# EAGLE design 1-WireThermocouple (EAGLE 9.3.1)
AUTHOR: KTOWN
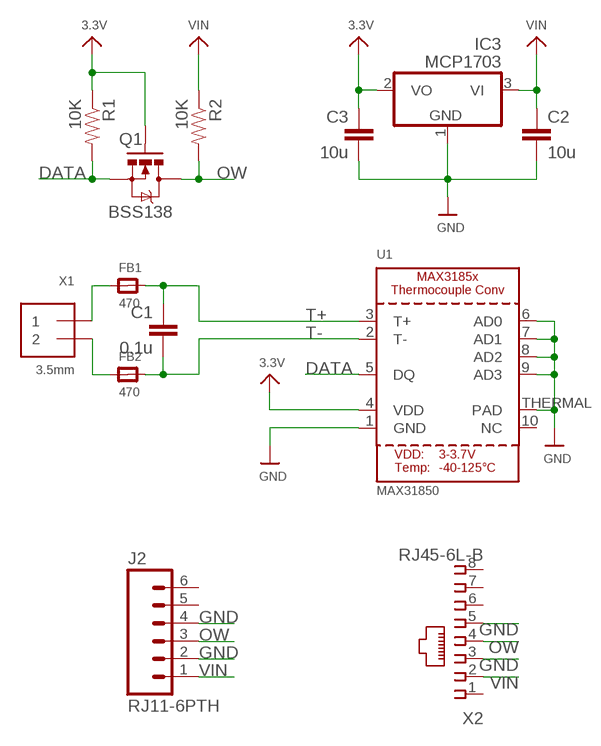
[diagram p0: schematic, sheet 1]

## Parts
C1  0.1u  CAP0603-CAP  [0603-CAP]
C2  10u  CAP0603-CAP  [0603-CAP]
C3  10u  CAP0603-CAP  [0603-CAP]
FB1  470  FERRITE  [0603]
FB2  470  FERRITE  [0603]
IC3  MCP1703  MCP1703CB  [SOT23]
J2  RJ11-6PTH  [RJ11-6]
Q1  BSS138  MOSFET-NCHANNELSMD  [SOT23-3]
R1  10K  RESISTOR0603-RES  [0603-RES]
R2  10K  RESISTOR0603-RES  [0603-RES]
U1  MAX31850  MAX3185X  [TDFN10_3X4MM]
X1  3.5mm  TERMBLOCK_1X2  [TERMBLOCK_1X2-3.5MM]
X2  RJ45-6L-B  [RJ45-NO-SHIELD]

## Nets
3.3V: C3.1 IC3.2(VO) Q1.1(G) R1.1 U1.4(VDD)
DATA: Q1.2(S) R1.2 U1.5(DQ)
GND: C2.2 C3.2 IC3.1(GND) J2.2 J2.4 U1.1(GND) U1.6(AD0) U1.7(AD1) U1.8(AD2) U1.9(AD3) U1.THERMAL(PAD) X2.3 X2.5
N$1: FB1.1 X1.1
N$2: FB2.1 X1.2
OW: J2.3 Q1.3(D) R2.2 X2.4
T+: C1.1 FB1.2 U1.3(T+)
T-: C1.2 FB2.2 U1.2(T-)
VIN: C2.1 IC3.3(VI) J2.1 R2.1 X2.2
Unconnected: J2.5 J2.6 U1.10(NC) X2.1 X2.6 X2.7 X2.8

## Library data of the parts
C1-C3 = SparkFun:CAP: Capacitor Standard 0603 ceramic capacitor, and 0.1" leaded capacitor.
FB1 FB2 = microbuilder:FERRITE: Ferrite Bead 0603 MMZ1608B121C - 120 Ohm @ 100MHz, 600mA, 0.15 Ohm DC Resistance - Digikey: 445-2164-1-ND BK1608HW121-T - 120 Ohm, 600mA Ferrite Chip - Digikey: 587-1876-2-ND 0805 HZ0805B272R-10 - 2.7K Ohm @ 100MHz, 200mA, 0.8 Ohm DC Resistance - Digikey: 240-2504-1-ND (see also Murata BLM21BD272SN1L) MMZ2012Y152B - 1.5K Ohm @ 100MHz, 500mA, 0.4 Ohm DC Resistance - Digikey: 445-1560-1-ND - Mainly for high frequency (80-400MHz) MMZ2012R102A - 1K Ohm @ 100MHz, 500mA, 0.3 Ohm DC Resistance - Digikey: 445-1555-2-ND - More general purpose (10-200MHz)
IC3 = linear:MCP1703: 250 mA, 16V, Low Quiescent Current LDO Regulator Source: http://ww1.microchip.com/downloads/en/DeviceDoc/22049b.pdf
J2 = SparkFun:RJ11-6: RJ11 Jack Simple 6 pin RJ11 jack. Commonly found on CAT3 devices and Microchip programmers. SKU: PRT-00132
Q1 = SparkFun:MOSFET-NCHANNEL
R1 R2 = SparkFun:RESISTOR: Resistor Basic schematic elements and footprints for 0603, 1206, and PTH resistors.
U1 = microbuilder:MAX3185X: MAX31850/MAX31851 One-Wire Thermocouple to Digital Converter
X1 = microbuilder:TERMBLOCK_1X2: 3.5mm Terminal block http://www.ladyada.net/library/pcb/eaglelibrary.html
X2 = con-tycoelectronics:RJ45: CORCOM Modular RJ Jacks No Shield Source: www.tycoelectronics.com .. ENG_DS_1654001_1099_RJ_L_0507.pdf; MPN: RJ45-6L-B; OC_FARNELL: unknown; OC_NEWARK: 16R6090

## Board
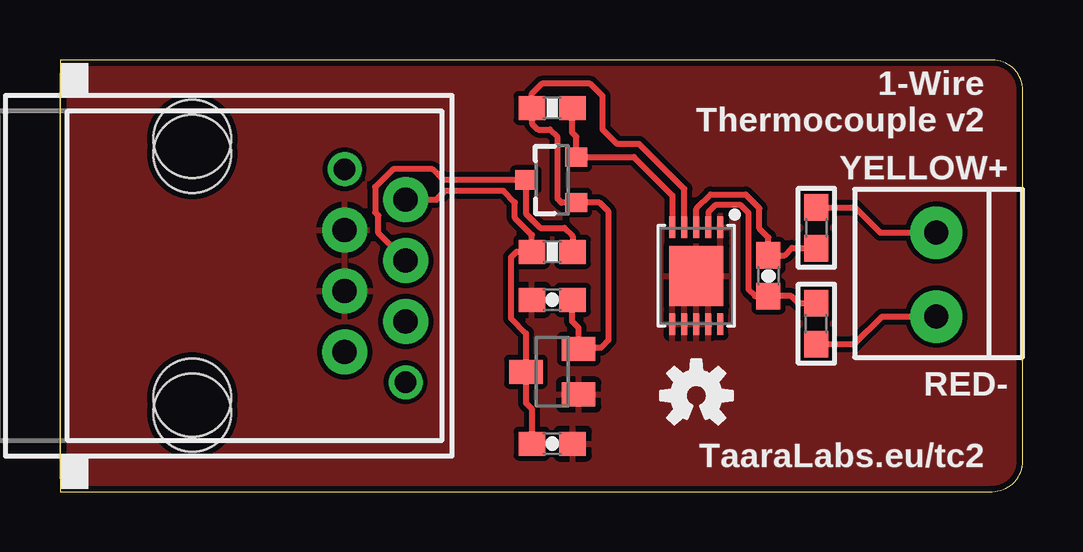
[diagram p1: board, top side]
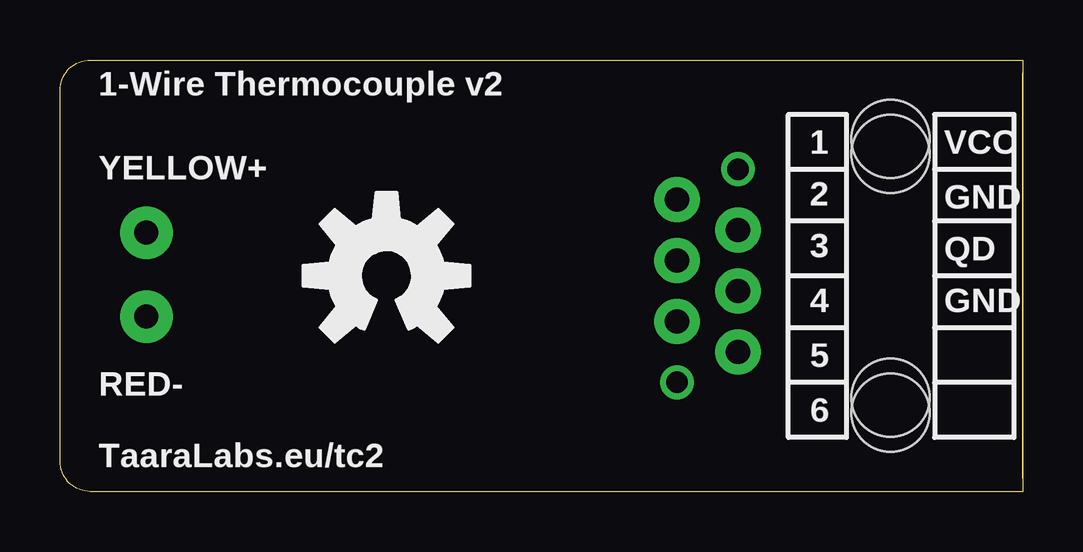
[diagram p2: board, bottom side, seen from below]

Size 40.11 x 18 mm. Coordinates in mm from the lower left corner, seen from the top.
Outline: 0,0 38.84,0 arc90 40.11,1.27 40.11,16.73 arc90 38.84,18 0,18 0,0
Copper layers (1*16): Top 0.035mm / dielectric 1.5mm / Bottom 0.035mm
Design rules "adafruit": minimum track width 8mil, minimum drill 15.5mil, track to track 8mil, track to pad 8mil, pad to pad 8mil, via to via 8mil, smd to smd 8mil, copper to edge 10mil, drill to drill 8mil, minimum pad ring 10mil, minimum via ring 8mil, stop-mask expansion 4mil, vias tented up to drill 20mil, thermal gap 10mil

### Footprints (pad centres in the part's own frame; a part is rotated, then mirrored left to right if it is on the bottom)
0603-CAP = smd 1.1 x 1: 1 -0.85,0; 2 0.85,0
0603 = smd 1.1 x 1: 1 -0.85,0; 2 0.85,0
SOT23 = smd 1 x 1.4: 1 -0.95,-1.1; 2 0.95,-1.1; 3 0,1.1
RJ11-6 = drill 1.016 pad 1.88: 1 1.905,8.89; 2 3.175,6.35; 3 4.445,8.89; 4 5.715,6.35; 5 6.985,8.89; 6 8.255,6.35 | hole 3.251: 0,0; 10.16,0
SOT23-3 = smd 0.8 x 0.9: 1 -0.95,-1; 2 0.95,-1; 3 0,1.1
0603-RES = smd 1.1 x 1: 1 -0.85,0; 2 0.85,0
TDFN10_3X4MM = smd 0.25 x 0.9: 1 -1,-2.02; 2 -0.5,-2.02; 3 0,-2.02; 4 0.5,-2.02; 5 1,-2.02; 6 1,2.02; 7 0.5,2.02; 8 0,2.02; 9 -0.5,2.02; 10 -1,2.02 | smd 2.25 x 2.5: THERMAL 0,0
TERMBLOCK_1X2-3.5MM = drill 1 pad 2.184: 1 1.8,0; 2 -1.7,0
RJ45-NO-SHIELD = drill 0.9 pad 1.4: 1 -4.445,6.35; 2 -3.175,8.89; 3 -1.905,6.35; 4 -0.635,8.89; 5 0.635,6.35; 6 1.905,8.89; 7 3.175,6.35; 8 4.445,8.89 | hole 3.251: -5.715,0; 5.715,0

### Placement (x,y rotation side)
C1  29.51,9 270 top
C2  20.51,2 0 top
C3  20.51,8 180 top
FB1  31.51,11 270 top
FB2  31.51,7 90 top
IC3  20.51,5 90 top
J2  5.51,14.08 270 top
Q1  20.51,13 90 top
R1  20.51,16 0 top
R2  20.51,10 0 top
U1  26.51,9 180 top
U$1  [OSHW-LOGO-S]  26.51,4 0 top
U$8  [OSHW-LOGO-L]  26.51,9 0 bottom
X1  36.51,9 90 top
X2  5.51,9 270 top

### Tracks (layer width: path | path; a pad name or v marks a point on that pad's centre or on a via)
3.3V
  Top 0.254: U1.4 26.01,12.62 24.13,14.5 23.21,14.5 22.61,15.1 22.61,16.49 22.1,17 20.07,17 19.66,16.59 R1.1 19.66,15.35 19.91,15.1 20.41,15.1 20.73,14.78 20.73,12.21 20.89,12.05 Q1.1 22.48,12.05 22.86,11.67 22.86,6.32 22.55,6 21.61,6 | IC3.2 21.61,6 | 21.61,6 21.61,6.82 21.34,7.1 21.34,7.98 C3.1
DATA
  Top 0.254: R1.2 21.34,15.98 21.34,14.97 21.51,14.8 Q1.2 23.91,13.95 25.51,12.35 U1.5
GND
  pour Top: 0,18 40.11,18 40.11,0 0,0
N$1
  Top 0.254: FB1.1 33.13,11.85 34.18,10.8 X1.1
N$2
  Top 0.254: FB2.1 33.1,6.15 34.25,7.3 X1.2
OW
  Top 0.254: R2.2 21.36,10.65 21.01,11 20.01,11 19.41,11.6 Q1.3 15.97,13 15.53,13.45 13.88,13.45 13.13,12.7 13.13,11.65 13.26,11.52 13.26,10.78 X2.4
T+
  Top 0.254: FB1.2 30.5,10.16 30.19,9.85 C1.1 29.51,10.6 29.14,10.97 29.14,11.82 28.56,12.39 27.11,12.39 26.51,11.8 U1.3
T-
  Top 0.254: U1.2 27.01,11.65 27.3,11.94 28.37,11.94 28.68,11.63 28.68,8.43 28.96,8.15 C1.2 30.48,8.15 30.78,7.85 FB2.2
VIN
  Top 0.254: C2.1 19.66,3.44 19.41,3.69 IC3.3 19.41,6.6 18.78,7.23 18.78,9.77 19.01,10 R2.1 19.66,10.7 18.95,11.41 18.95,12.06 18.47,12.54 16.05,12.54 15.69,12.18 X2.2

### Text on the board
tNames: 1-Wire / Thermocouple v2 | YELLOW+ | RED- | TaaraLabs.eu/tc2
bNames: 1-Wire Thermocouple v2 | VCC | 1 | YELLOW+ | GND | 2 | QD | 3 | GND | 4 | 5 | RED- | 6 | TaaraLabs.eu/tc2
tValues: Ferrite